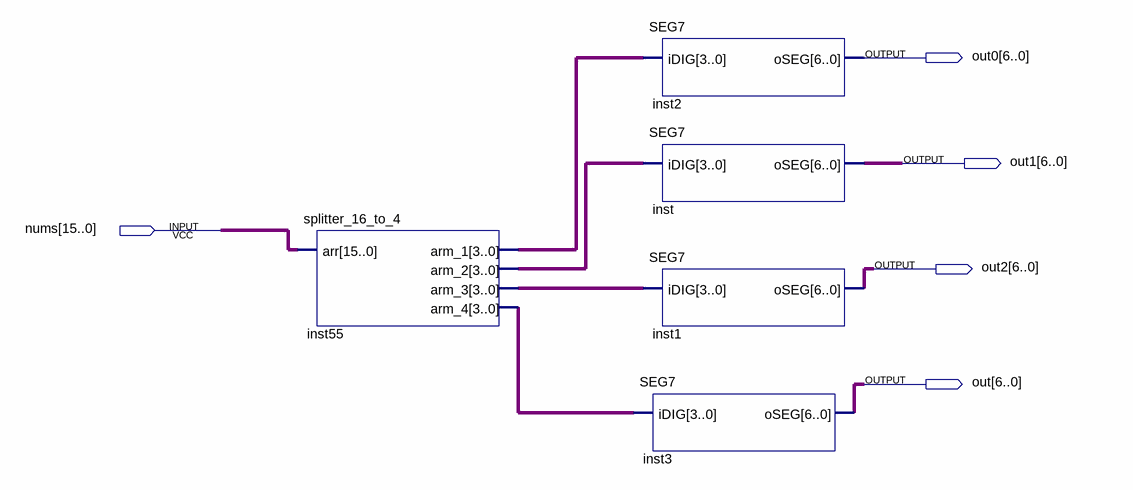
[diagram p0: schematic sheet]
// Quartus schematic seg_fuel_display.bdf as structural Verilog: 5 symbols, 5 pins
module seg_fuel_display (
  input  [15:0] nums,
  output [6:0] out0,
  output [6:0] out1,
  output [6:0] out2,
  output [6:0] out
);

  wire [3:0] inst55_arm_1, inst55_arm_2, inst55_arm_3, inst55_arm_4;

  splitter_16_to_4 inst55 (
    .arr(nums), .arm_1(inst55_arm_1), .arm_2(inst55_arm_2), .arm_3(inst55_arm_3), .arm_4(inst55_arm_4));
  SEG7 inst2 (.iDIG(inst55_arm_1), .oSEG(out0));
  SEG7 inst (.iDIG(inst55_arm_2), .oSEG(out1));
  SEG7 inst1 (.iDIG(inst55_arm_3), .oSEG(out2));
  SEG7 inst3 (.iDIG(inst55_arm_4), .oSEG(out));
endmodule
